# Altium project IPT-LXe.PrjPCB (part 1 of 2)
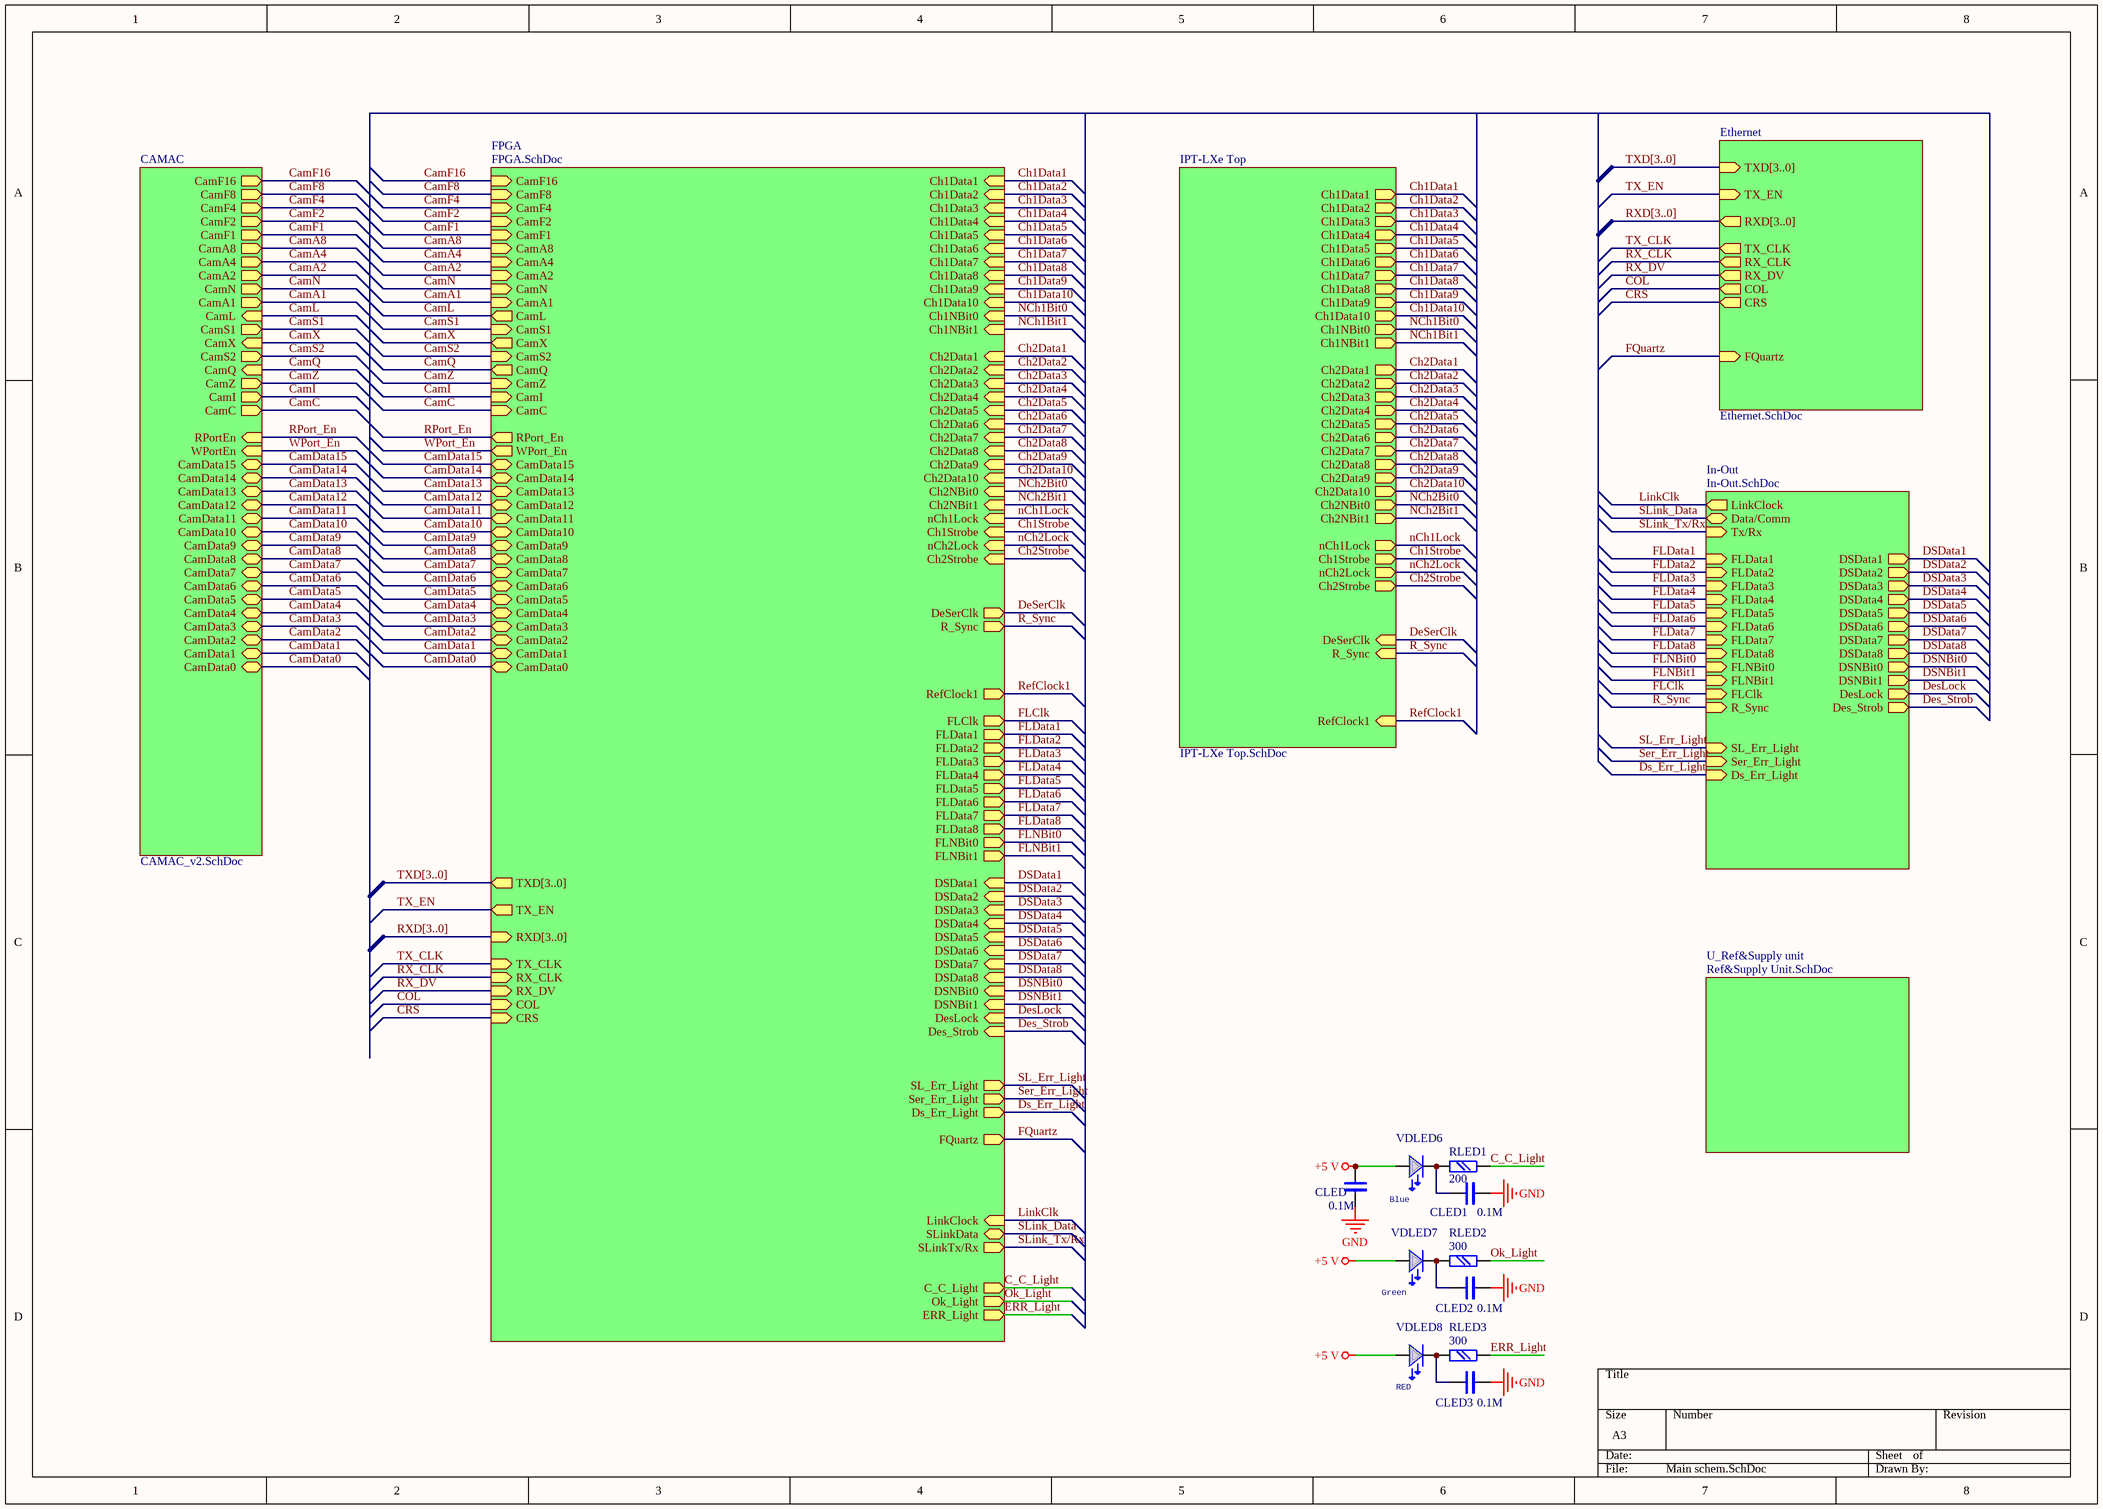
[diagram p0: Main schem.SchDoc]
6 sheets, 225 parts. Net scope: hierarchical (ports join the sheet entries above them; power ports are global).
Board file: IPT-LXe.PcbDoc
Sheets:
  Main schem.SchDoc
    U_Ref&Supply unit = Ref&Supply Unit.SchDoc
    In-Out = In-Out.SchDoc
    CAMAC = CAMAC_v2.SchDoc
    IPT-LXe Top = IPT-LXe Top.SchDoc
    FPGA = FPGA.SchDoc

## Sheet Main schem.SchDoc
size A3

### Parts
CLED  0.1M  [chip0805]
CLED1  0.1M  [chip0805]
CLED2  0.1M  [chip0805]
CLED3  0.1M  [chip0805]
RLED1  200  [chip0805]
RLED2  300  [chip0805]
RLED3  300  [chip0805]
VDLED6  LED  [LED2P5_H]  (value not drawn)
VDLED7  LED  [LED2P5_H]  (value not drawn)
VDLED8  LED  [LED2P5_H]  (value not drawn)

### Sub-sheets
CAMAC = CAMAC_v2.SchDoc: CamF1 (out), CamF2 (out), CamF4 (out), CamF8 (out), CamF16 (out), CamA8 (out), CamA4 (out), CamA2 (out), CamA1 (out), CamN (out), CamS1 (out), CamS2 (out), CamL (in), CamX (in), CamQ (in), CamData1 (bidir), CamData2 (bidir), CamData3 (bidir), CamData4 (bidir), CamData5 (bidir), CamData6 (bidir), CamData7 (bidir), CamData8 (bidir), CamData9 (bidir), CamData10 (bidir), CamData11 (bidir), CamData12 (bidir), CamData13 (bidir), CamData14 (bidir), CamData15 (bidir), CamData0 (bidir), CamI (out), CamZ (out), CamC (out), WPortEn (in), RPortEn (in)
Ethernet = Ethernet.SchDoc (file not in this document): COL (out), TX_EN (in), TX_CLK (out), RX_CLK (out), RX_DV (out), TXD[3..0] (in), RXD[3..0] (out), CRS (out), FQuartz (in)
FPGA = FPGA.SchDoc: ERR_Light (out), Ok_Light (out), C_C_Light (out), SLinkData (bidir), SLinkTx/Rx (out), Ch1Data1 (in), Ch1Data2 (in), Ch1Data3 (in), Ch1Data4 (in), Ch1Data5 (in), Ch1Data6 (in), Ch1Data7 (in), Ch1Data8 (in), Ch1NBit0 (in), Ch1NBit1 (in), Ch1Data9 (in), Ch1Data10 (in), LinkClock (in), CamF1 (in), CamF2 (in), CamF4 (in), CamF8 (in), CamF16 (in), CamA8 (in), CamA4 (in), CamA2 (in), CamA1 (in), CamN (in), CamS1 (in), CamS2 (in), CamL (out), CamX (out), CamQ (out), Ch2Data1 (in), Ch2Data2 (in), Ch2Data3 (in), Ch2Data4 (in), Ch2Data5 (in), Ch2Data6 (in), Ch2Data7 (in), Ch2Data8 (in), Ch2NBit0 (in), Ch2NBit1 (in), DeSerClk (out), R_Sync (out), Ch2Data9 (in), Ch2Data10 (in), nCh2Lock (in), Ch2Strobe (in), nCh1Lock (in), Ch1Strobe (in), RefClock1 (out), CamData1 (bidir), CamData2 (bidir), CamData3 (bidir), CamData4 (bidir), CamData5 (bidir), CamData6 (bidir), CamData7 (bidir), CamData8 (bidir), CamData9 (bidir), CamData10 (bidir), CamData11 (bidir), CamData12 (bidir), CamData13 (bidir), CamData14 (bidir), CamData15 (bidir), CamData0 (bidir), FLData1 (out), FLData2 (out), FLData3 (out), FLData4 (out), FLData5 (out), FLData6 (out), FLData7 (out), FLData8 (out), FLNBit0 (out), FLNBit1 (out), DSData1 (in), DSData2 (in), DSData3 (in), DSData4 (in), DSData5 (in), DSData6 (in), DSData7 (in), DSData8 (in), DSNBit0 (in), DSNBit1 (in), DesLock (in), Des_Strob (in), CamI (in), CamZ (in), CamC (in), Ser_Err_Light (out), Ds_Err_Light (out), FQuartz (out), SL_Err_Light (out), COL (in), TX_EN (out), TX_CLK (in), RX_CLK (in), RX_DV (in), TXD[3..0] (out), CRS (in), RXD[3..0] (in), WPort_En (out), RPort_En (out), FLClk (out)
In-Out = In-Out.SchDoc: Tx/Rx (in), Data/Comm (bidir), LinkClock (out), FLData1 (in), FLData2 (in), FLData3 (in), FLData4 (in), FLData5 (in), FLData6 (in), FLData7 (in), FLData8 (in), FLNBit0 (in), FLNBit1 (in), FLClk (in), R_Sync (in), DSData1 (out), DSData2 (out), DSData3 (out), DSData4 (out), DSData5 (out), DSData6 (out), DSData7 (out), DSData8 (out), DSNBit0 (out), DSNBit1 (out), DesLock (out), Des_Strob (out), Ser_Err_Light (in), Ds_Err_Light (in), SL_Err_Light (in)
IPT-LXe Top = IPT-LXe Top.SchDoc: RefClock1 (in), Ch1Data1 (out), Ch1Data2 (out), Ch1Data3 (out), Ch1Data4 (out), Ch1Data5 (out), Ch1Data6 (out), Ch1Data7 (out), Ch1Data8 (out), Ch1NBit0 (out), Ch1NBit1 (out), Ch1Data9 (out), Ch1Data10 (out), Ch2Data1 (out), Ch2Data2 (out), Ch2Data3 (out), Ch2Data4 (out), Ch2Data5 (out), Ch2Data6 (out), Ch2Data7 (out), Ch2Data8 (out), Ch2NBit0 (out), Ch2NBit1 (out), Ch2Data9 (out), Ch2Data10 (out), DeSerClk (in), R_Sync (in), nCh2Lock (out), Ch2Strobe (out), nCh1Lock (out), Ch1Strobe (out)
U_Ref&Supply unit = Ref&Supply Unit.SchDoc: no entries

### Nets
+5 V: CLED.1 VDLED6.ANOD VDLED7.ANOD VDLED8.ANOD
gnd: CLED.2 CLED1.2 CLED2.2 CLED3.2
C_C_Light: RLED1.2 ; sheet FPGA/C_C_Light
CamA1: sheet CAMAC/CamA1, sheet FPGA/CamA1  [project net A1]
CamA2: sheet CAMAC/CamA2, sheet FPGA/CamA2  [project net A2]
CamA4: sheet CAMAC/CamA4, sheet FPGA/CamA4  [project net A4]
CamA8: sheet CAMAC/CamA8, sheet FPGA/CamA8  [project net A8]
CamC: sheet CAMAC/CamC, sheet FPGA/CamC  [project net C]
CamData0: sheet CAMAC/CamData0, sheet FPGA/CamData0  [project net Cam_Data0]
CamData1: sheet CAMAC/CamData1, sheet FPGA/CamData1  [project net Cam_Data1]
CamData2: sheet CAMAC/CamData2, sheet FPGA/CamData2  [project net Cam_Data2]
CamData3: sheet CAMAC/CamData3, sheet FPGA/CamData3  [project net Cam_Data3]
CamData4: sheet CAMAC/CamData4, sheet FPGA/CamData4  [project net Cam_Data4]
CamData5: sheet CAMAC/CamData5, sheet FPGA/CamData5  [project net Cam_Data5]
CamData6: sheet CAMAC/CamData6, sheet FPGA/CamData6  [project net Cam_Data6]
CamData7: sheet CAMAC/CamData7, sheet FPGA/CamData7  [project net Cam_Data7]
CamData8: sheet CAMAC/CamData8, sheet FPGA/CamData8  [project net Cam_Data8]
CamData9: sheet CAMAC/CamData9, sheet FPGA/CamData9  [project net Cam_Data9]
CamData10: sheet CAMAC/CamData10, sheet FPGA/CamData10  [project net Cam_Data10]
CamData11: sheet CAMAC/CamData11, sheet FPGA/CamData11  [project net Cam_Data11]
CamData12: sheet CAMAC/CamData12, sheet FPGA/CamData12  [project net Cam_Data12]
CamData13: sheet CAMAC/CamData13, sheet FPGA/CamData13  [project net Cam_Data13]
CamData14: sheet CAMAC/CamData14, sheet FPGA/CamData14  [project net Cam_Data14]
CamData15: sheet CAMAC/CamData15, sheet FPGA/CamData15  [project net Cam_Data15]
CamF1: sheet CAMAC/CamF1, sheet FPGA/CamF1
CamF2: sheet CAMAC/CamF2, sheet FPGA/CamF2
CamF4: sheet CAMAC/CamF4, sheet FPGA/CamF4
CamF8: sheet CAMAC/CamF8, sheet FPGA/CamF8
CamF16: sheet CAMAC/CamF16, sheet FPGA/CamF16
CamI: sheet CAMAC/CamI, sheet FPGA/CamI
CamL: sheet CAMAC/CamL, sheet FPGA/CamL
CamN: sheet CAMAC/CamN, sheet FPGA/CamN
CamQ: sheet CAMAC/CamQ, sheet FPGA/CamQ
CamS1: sheet CAMAC/CamS1, sheet FPGA/CamS1
CamS2: sheet CAMAC/CamS2, sheet FPGA/CamS2
CamX: sheet CAMAC/CamX, sheet FPGA/CamX
CamZ: sheet CAMAC/CamZ, sheet FPGA/CamZ
Ch1Data1: sheet IPT-LXe Top/Ch1Data1, sheet FPGA/Ch1Data1
Ch1Data2: sheet IPT-LXe Top/Ch1Data2, sheet FPGA/Ch1Data2
Ch1Data3: sheet IPT-LXe Top/Ch1Data3, sheet FPGA/Ch1Data3
Ch1Data4: sheet IPT-LXe Top/Ch1Data4, sheet FPGA/Ch1Data4
Ch1Data5: sheet IPT-LXe Top/Ch1Data5, sheet FPGA/Ch1Data5
Ch1Data6: sheet IPT-LXe Top/Ch1Data6, sheet FPGA/Ch1Data6
Ch1Data7: sheet IPT-LXe Top/Ch1Data7, sheet FPGA/Ch1Data7
Ch1Data8: sheet IPT-LXe Top/Ch1Data8, sheet FPGA/Ch1Data8
Ch1Data9: sheet IPT-LXe Top/Ch1Data9, sheet FPGA/Ch1Data9
Ch1Data10: sheet IPT-LXe Top/Ch1Data10, sheet FPGA/Ch1Data10
Ch1Strobe: sheet IPT-LXe Top/Ch1Strobe, sheet FPGA/Ch1Strobe
Ch2Data1: sheet IPT-LXe Top/Ch2Data1, sheet FPGA/Ch2Data1
Ch2Data2: sheet IPT-LXe Top/Ch2Data2, sheet FPGA/Ch2Data2
Ch2Data3: sheet IPT-LXe Top/Ch2Data3, sheet FPGA/Ch2Data3
Ch2Data4: sheet IPT-LXe Top/Ch2Data4, sheet FPGA/Ch2Data4
Ch2Data5: sheet IPT-LXe Top/Ch2Data5, sheet FPGA/Ch2Data5
Ch2Data6: sheet IPT-LXe Top/Ch2Data6, sheet FPGA/Ch2Data6
Ch2Data7: sheet IPT-LXe Top/Ch2Data7, sheet FPGA/Ch2Data7
Ch2Data8: sheet IPT-LXe Top/Ch2Data8, sheet FPGA/Ch2Data8
Ch2Data9: sheet IPT-LXe Top/Ch2Data9, sheet FPGA/Ch2Data9
Ch2Data10: sheet IPT-LXe Top/Ch2Data10, sheet FPGA/Ch2Data10
Ch2Strobe: sheet IPT-LXe Top/Ch2Strobe, sheet FPGA/Ch2Strobe
COL: sheet Ethernet/COL, sheet FPGA/COL
CRS: sheet Ethernet/CRS, sheet FPGA/CRS
Des_Strob: sheet In-Out/Des_Strob, sheet FPGA/Des_Strob
DeSerClk: sheet IPT-LXe Top/DeSerClk, sheet FPGA/DeSerClk
DesLock: sheet In-Out/DesLock, sheet FPGA/DesLock
Ds_Err_Light: sheet In-Out/Ds_Err_Light, sheet FPGA/Ds_Err_Light
DSData1: sheet In-Out/DSData1, sheet FPGA/DSData1  [project net Des_Out0]
DSData2: sheet In-Out/DSData2, sheet FPGA/DSData2  [project net Des_Out1]
DSData3: sheet In-Out/DSData3, sheet FPGA/DSData3  [project net Des_Out2]
DSData4: sheet In-Out/DSData4, sheet FPGA/DSData4  [project net Des_Out3]
DSData5: sheet In-Out/DSData5, sheet FPGA/DSData5  [project net Des_Out4]
DSData6: sheet In-Out/DSData6, sheet FPGA/DSData6  [project net Des_Out5]
DSData7: sheet In-Out/DSData7, sheet FPGA/DSData7  [project net Des_Out6]
DSData8: sheet In-Out/DSData8, sheet FPGA/DSData8  [project net Des_Out7]
DSNBit0: sheet In-Out/DSNBit0, sheet FPGA/DSNBit0  [project net Des_Out8]
DSNBit1: sheet In-Out/DSNBit1, sheet FPGA/DSNBit1  [project net Des_Out9]
ERR_Light: RLED3.2 ; sheet FPGA/ERR_Light
FLClk: sheet In-Out/FLClk, sheet FPGA/FLClk
FLData1: sheet In-Out/FLData1, sheet FPGA/FLData1
FLData2: sheet In-Out/FLData2, sheet FPGA/FLData2
FLData3: sheet In-Out/FLData3, sheet FPGA/FLData3
FLData4: sheet In-Out/FLData4, sheet FPGA/FLData4
FLData5: sheet In-Out/FLData5, sheet FPGA/FLData5
FLData6: sheet In-Out/FLData6, sheet FPGA/FLData6
FLData7: sheet In-Out/FLData7, sheet FPGA/FLData7
FLData8: sheet In-Out/FLData8, sheet FPGA/FLData8
FLNBit0: sheet In-Out/FLNBit0, sheet FPGA/FLNBit0
FLNBit1: sheet In-Out/FLNBit1, sheet FPGA/FLNBit1
FQuartz: sheet Ethernet/FQuartz, sheet FPGA/FQuartz
LinkClk: sheet In-Out/LinkClock, sheet FPGA/LinkClock
NCh1Bit0: sheet IPT-LXe Top/Ch1NBit0, sheet FPGA/Ch1NBit0  [project net Ch1Data11]
NCh1Bit1: sheet IPT-LXe Top/Ch1NBit1, sheet FPGA/Ch1NBit1  [project net Ch1Data12]
nCh1Lock: sheet IPT-LXe Top/nCh1Lock, sheet FPGA/nCh1Lock
NCh2Bit0: sheet IPT-LXe Top/Ch2NBit0, sheet FPGA/Ch2NBit0  [project net Ch2Data11]
NCh2Bit1: sheet IPT-LXe Top/Ch2NBit1, sheet FPGA/Ch2NBit1  [project net Ch2Data12]
nCh2Lock: sheet IPT-LXe Top/nCh2Lock, sheet FPGA/nCh2Lock
Ok_Light: RLED2.2 ; sheet FPGA/Ok_Light
R_Sync: sheet In-Out/R_Sync, sheet IPT-LXe Top/R_Sync, sheet FPGA/R_Sync
RefClock1: sheet IPT-LXe Top/RefClock1, sheet FPGA/RefClock1
RPort_En: sheet CAMAC/RPortEn, sheet FPGA/RPort_En
RX_CLK: sheet Ethernet/RX_CLK, sheet FPGA/RX_CLK  [project net EthRX_CLK]
RX_DV: sheet Ethernet/RX_DV, sheet FPGA/RX_DV  [project net EthRX_D V]
Ser_Err_Light: sheet In-Out/Ser_Err_Light, sheet FPGA/Ser_Err_Light
SL_Err_Light: sheet In-Out/SL_Err_Light, sheet FPGA/SL_Err_Light
SLink_Data: sheet In-Out/Data/Comm, sheet FPGA/SLinkData
SLink_Tx/Rx: sheet In-Out/Tx/Rx, sheet FPGA/SLinkTx/Rx
TX_CLK: sheet Ethernet/TX_CLK, sheet FPGA/TX_CLK  [project net EthTX_CLK]
TX_EN: sheet Ethernet/TX_EN, sheet FPGA/TX_EN  [project net EthTX_EN]
WPort_En: sheet CAMAC/WPortEn, sheet FPGA/WPort_En
NetCLED1_1: CLED1.1 RLED1.1 VDLED6.CATH
NetCLED2_1: CLED2.1 RLED2.1 VDLED7.CATH
NetCLED3_1: CLED3.1 RLED3.1 VDLED8.CATH

### Buses and harness runs
bus RXD[3..0] = sheet Ethernet/RXD[3..0]
bus RXD[3..0] = sheet FPGA/RXD[3..0]
bus TXD[3..0] = sheet Ethernet/TXD[3..0]
bus TXD[3..0] = sheet FPGA/TXD[3..0]

### Notes on the sheet
- Blue
- (near VDLED7) Green
- (near VDLED8) RED

### Library data of the parts
CLED CLED1-CLED3 = C: Text Field1: 20; Text Field2: 10
RLED1-RLED3 = R: Text Field1: 20; Text Field2: 20
VDLED6-VDLED8 = AL307: Text Field1: 10; Text Field2: 30

## Sheet Ref&Supply Unit.SchDoc
size A4
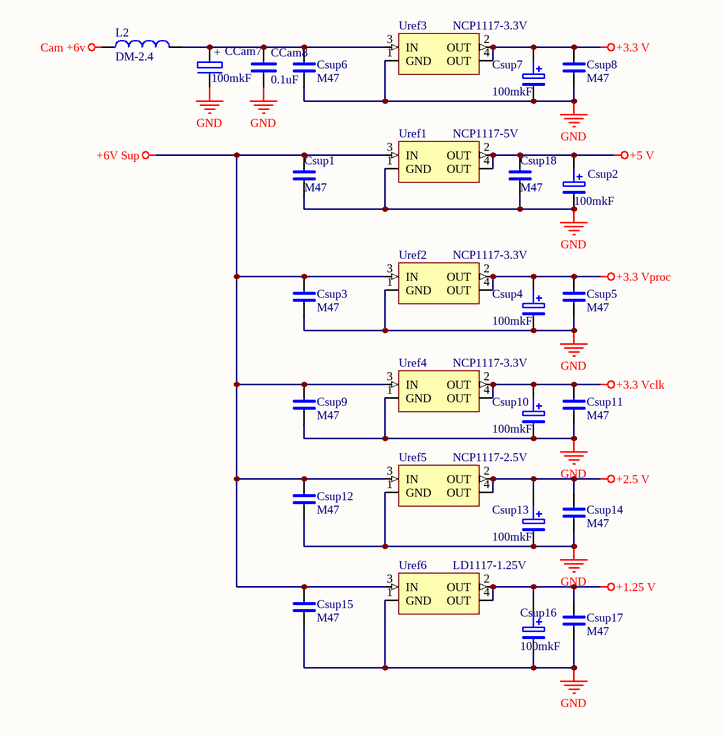
[diagram p1: Ref&Supply Unit.SchDoc]

### Parts
CCam7  100mkF  [CEL-SMD300]
CCam8  0.1uF  [chip0805]
Csup1  M47  [chip0805]
Csup2  100mkF  [CEL-SMD300]
Csup3  M47  [chip0805]
Csup4  100mkF  [CEL-SMD300]
Csup5  M47  [chip0805]
Csup6  M47  [chip0805]
Csup7  100mkF  [CEL-SMD300]
Csup8  M47  [chip0805]
Csup9  M47  [chip0805]
Csup10  100mkF  [CEL-SMD300]
Csup11  M47  [chip0805]
Csup12  M47  [chip0805]
Csup13  100mkF  [CEL-SMD300]
Csup14  M47  [chip0805]
Csup15  M47  [chip0805]
Csup16  100mkF  [CEL-SMD300]
Csup17  M47  [chip0805]
Csup18  M47  [chip0805]
L2  DM-2.4  [DM-2.4]
Uref1  NCP1117-5V  [SOT-223]
Uref2  NCP1117-3.3V  [TO-252]
Uref3  NCP1117-3.3V  [TO-252]
Uref4  NCP1117-3.3V  [TO-252]
Uref5  NCP1117-2.5V  [TO-252]
Uref6  LD1117-1.25V  [TO-252]

### Nets
+1.25 V: Csup16.+ Csup17.1 Uref6.2(OUT) Uref6.4(OUT)
+2.5 V: Csup13.+ Csup14.1 Uref5.2(OUT) Uref5.4(OUT)
+3.3 V: Csup7.+ Csup8.1 Uref3.2(OUT) Uref3.4(OUT)
+3.3 Vclk: Csup10.+ Csup11.1 Uref4.2(OUT) Uref4.4(OUT)
+3.3 Vproc: Csup4.+ Csup5.1 Uref2.2(OUT) Uref2.4(OUT)
+5 V: Csup2.+ Csup18.1 Uref1.2(OUT) Uref1.4(OUT)
+6V Sup: Csup1.1 Csup3.1 Csup9.1 Csup12.1 Csup15.1 Uref1.3(IN) Uref2.3(IN) Uref4.3(IN) Uref5.3(IN) Uref6.3(IN)
Cam +6v: L2.1
gnd: CCam7.- CCam8.2 Csup1.2 Csup2.- Csup3.2 Csup4.- Csup5.2 Csup6.2 Csup7.- Csup8.2 Csup9.2 Csup10.- Csup11.2 Csup12.2 Csup13.- Csup14.2 Csup15.2 Csup16.- Csup17.2 Csup18.2 Uref1.1(GND) Uref2.1(GND) Uref3.1(GND) Uref4.1(GND) Uref5.1(GND) Uref6.1(GND)
NetCCam7_+: CCam7.+ CCam8.1 Csup6.1 L2.2 Uref3.3(IN)

### Library data of the parts
CCam7 = C POL
CCam8 = C
Csup1 Csup3 Csup5 Csup6 Csup8 Csup9 Csup11 Csup12 Csup14 Csup15 Csup17 Csup18 = C: Text Field1: 20; Text Field2: 10
Csup2 Csup4 Csup7 Csup10 Csup13 Csup16 = C POL: Text Field1: 20; Text Field2: 20
L2 = INDUCTOR
Uref1 Uref5 Uref6 = NCP1117-3.3V

## Sheet In-Out.SchDoc
size A3
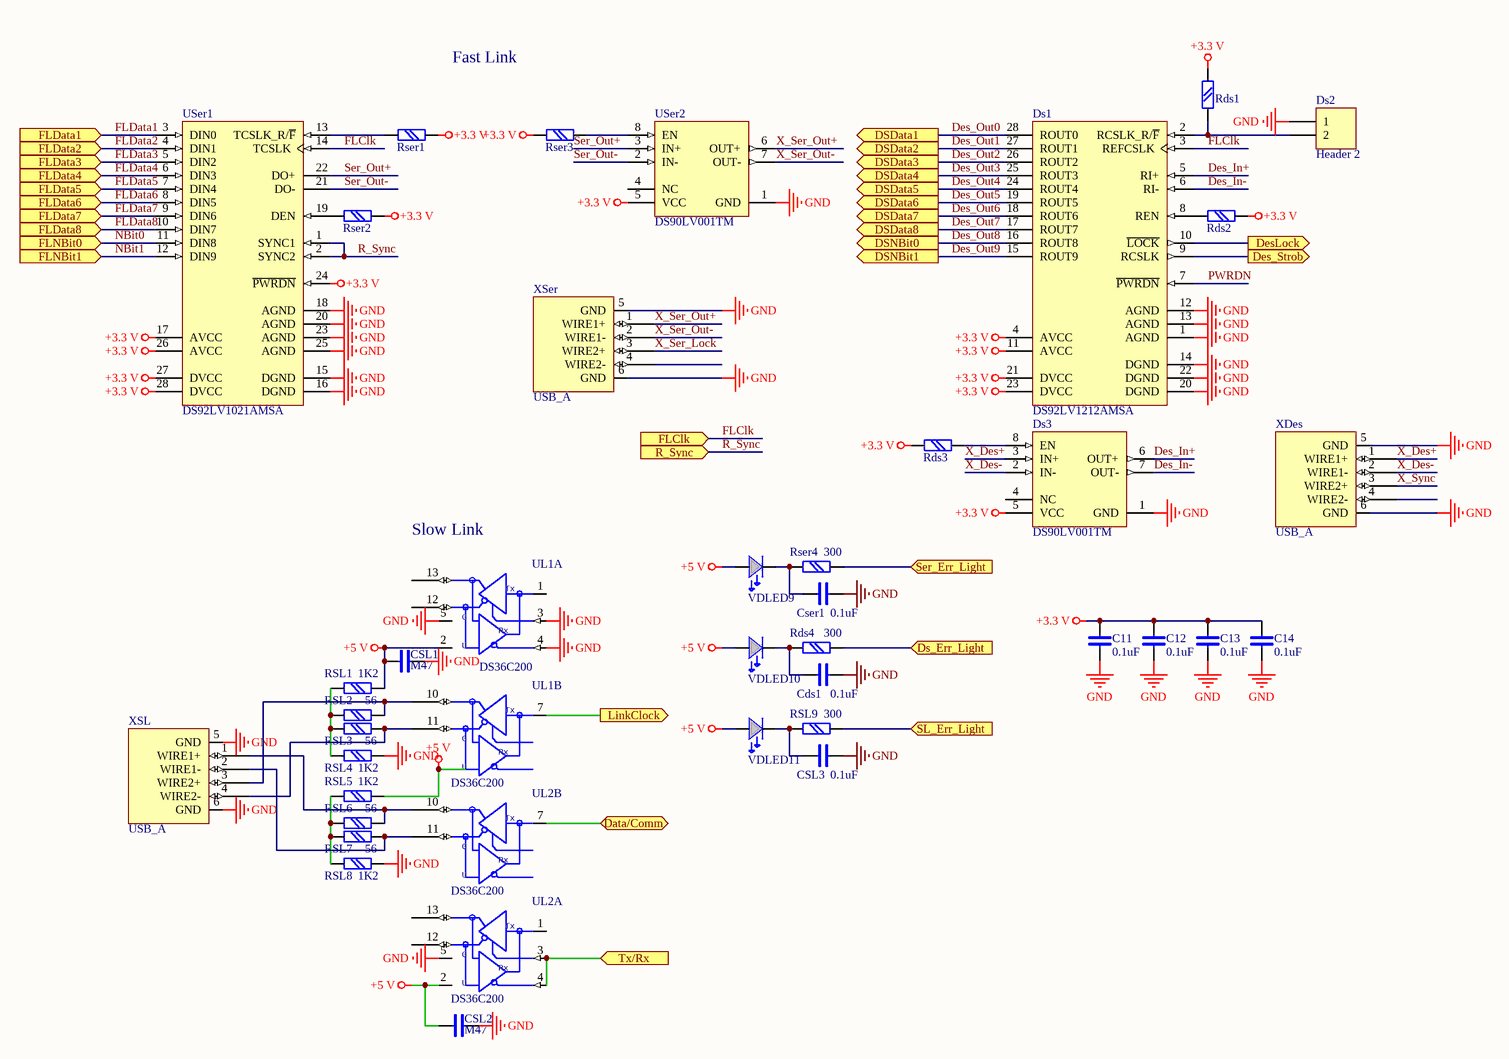
[diagram p2: In-Out.SchDoc]

### Parts
C11  0.1uF  [chip0805]
C12  0.1uF  [chip0805]
C13  0.1uF  [chip0805]
C14  0.1uF  [chip0805]
Cds1  0.1uF  [chip0805]
Cser1  0.1uF  [chip0805]
CSL1  M47  [chip0805]
CSL2  M47  [chip0805]
CSL3  0.1uF  [chip0805]
Ds1  DS92LV1212AMSA  [MSA28_N]
Ds2  Header 2  [HDR1X2]
Ds3  DS90LV001TM  [M08A_N]
Rds1  R  [chip0805]  (value not drawn)
Rds2  R  [chip0805]  (value not drawn)
Rds3  R  [chip0805]  (value not drawn)
Rds4  300  [chip0805]
Rser1  R  [chip0805]  (value not drawn)
Rser2  R  [chip0805]  (value not drawn)
Rser3  R  [chip0805]  (value not drawn)
Rser4  300  [chip0805]
RSL1  1K2  [chip0805]
RSL2  56  [chip0805]
RSL3  56  [chip0805]
RSL4  1K2  [chip0805]
RSL5  1K2  [chip0805]
RSL6  56  [chip0805]
RSL7  56  [chip0805]
RSL8  1K2  [chip0805]
RSL9  300  [chip0805]
UL1  DS36C200  [M14A_N]  (parts A,B of 2)
UL2  DS36C200  [M14A_N]  (parts A,B of 2)
USer1  DS92LV1021AMSA  [MSA28_N]
USer2  DS90LV001TM  [M08A_N]
VDLED9  LED  [LED2P5_H]  (value not drawn)
VDLED10  LED  [LED2P5_H]  (value not drawn)
VDLED11  LED  [LED2P5_H]  (value not drawn)
XDes  USB_A  [USB2.5-2H4B]
XSer  USB_A  [USB2.5-2H4B]
XSL  USB_A  [USB2.5-2H4B]

### Ports
Data/Comm (bidir), Des_Strob (out), DesLock (out), Ds_Err_Light (in), DSData1 (out), DSData2 (out), DSData3 (out), DSData4 (out), DSData5 (out), DSData6 (out), DSData7 (out), DSData8 (out), DSNBit0 (out), DSNBit1 (out), FLClk (in), FLData1 (in), FLData2 (in), FLData3 (in), FLData4 (in), FLData5 (in), FLData6 (in), FLData7 (in), FLData8 (in), FLNBit0 (in), FLNBit1 (in), LinkClock (out), R_Sync (in), Ser_Err_Light (in), SL_Err_Light (in), Tx/Rx (in)

### Nets
+3.3 V: C11.2 C12.2 C13.2 C14.2 Ds1.4(AVCC) Ds1.11(AVCC) Ds1.21(DVCC) Ds1.23(DVCC) Ds3.5(VCC) Rds1.1 Rds2.2 Rds3.2 Rser1.1 Rser2.2 Rser3.2 USer1.17(AVCC) USer1.24(~{PWRDN}) USer1.26(AVCC) USer1.27(DVCC) USer1.28(DVCC) USer2.5(VCC)
+5 V: CSL1.1 CSL2.1 RSL1.2 RSL5.2 UL1.2(VCC) UL2.2(VCC) VDLED9.ANOD VDLED10.ANOD VDLED11.ANOD
gnd: C11.1 C12.1 C13.1 C14.1 Cds1.2 Cser1.2 CSL1.2 CSL2.2 CSL3.2 Ds1.1(AGND) Ds1.12(AGND) Ds1.13(AGND) Ds1.14(DGND) Ds1.20(DGND) Ds1.22(DGND) Ds2.1 Ds3.1(GND) RSL4.2 RSL8.2 UL1.3(TE) UL1.4(RE) UL1.5(GND) UL2.5(GND) USer1.15(DGND) USer1.16(DGND) USer1.18(AGND) USer1.20(AGND) USer1.23(AGND) USer1.25(AGND) USer2.1(GND) XDes.5(GND) XDes.6(GND) XSer.5(GND) XSer.6(GND) XSL.5(GND) XSL.6(GND)
Des_In+: Ds1.5(RI+) Ds3.6(OUT+)
Des_In-: Ds1.6(RI-) Ds3.7(OUT-)
Des_Out0: Ds1.28(ROUT0) ; port DSData1
Des_Out1: Ds1.27(ROUT1) ; port DSData2
Des_Out2: Ds1.26(ROUT2) ; port DSData3
Des_Out3: Ds1.25(ROUT3) ; port DSData4
Des_Out4: Ds1.24(ROUT4) ; port DSData5
Des_Out5: Ds1.19(ROUT5) ; port DSData6
Des_Out6: Ds1.18(ROUT6) ; port DSData7
Des_Out7: Ds1.17(ROUT7) ; port DSData8
Des_Out8: Ds1.16(ROUT8) ; port DSNBit0
Des_Out9: Ds1.15(ROUT9) ; port DSNBit1
Des_Strob: Ds1.9(RCSLK) ; port Des_Strob
DesLock: Ds1.10(~{LOCK}) ; port DesLock
Ds_Err_Light: Rds4.1 ; port Ds_Err_Light
FLClk: Ds1.3(REFCSLK) USer1.14(TCSLK) ; port FLClk
FLData1: USer1.3(DIN0) ; port FLData1
FLData2: USer1.4(DIN1) ; port FLData2
FLData3: USer1.5(DIN2) ; port FLData3
FLData4: USer1.6(DIN3) ; port FLData4
FLData5: USer1.7(DIN4) ; port FLData5
FLData6: USer1.8(DIN5) ; port FLData6
FLData7: USer1.9(DIN6) ; port FLData7
FLData8: USer1.10(DIN7) ; port FLData8
LinkClk: UL1.7(DATA) ; port LinkClock
NBit0: USer1.11(DIN8) ; port FLNBit0  [project net FLNBit0]
NBit1: USer1.12(DIN9) ; port FLNBit1  [project net FLNBit1]
PWRDN: Ds1.7(~{PWRDN})
R_Sync: USer1.1(SYNC1) USer1.2(SYNC2) ; port R_Sync
Ser_Err_Light: Rser4.1 ; port Ser_Err_Light
Ser_Out+: USer1.22(DO+) USer2.3(IN+)
Ser_Out-: USer1.21(DO-) USer2.2(IN-)
SL_Err_Light: RSL9.1 ; port SL_Err_Light
SLink_Data: UL2.7(DATA) ; port Data/Comm
SLink_Tx/Rx: UL2.3(TE) UL2.4(RE) ; port Tx/Rx
X_Des+: Ds3.3(IN+) XDes.1(WIRE1+)
X_Des-: Ds3.2(IN-) XDes.2(WIRE1-)
X_Ser_Lock: XSer.3(WIRE2+)
X_Ser_Out+: USer2.6(OUT+) XSer.1(WIRE1+)
X_Ser_Out-: USer2.7(OUT-) XSer.2(WIRE1-)
X_Sync: XDes.3(WIRE2+)
NetCds1_1: Cds1.1 Rds4.2 VDLED10.CATH
NetCser1_1: Cser1.1 Rser4.2 VDLED9.CATH
NetCSL3_1: CSL3.1 RSL9.2 VDLED11.CATH
NetDs1_2: Ds1.2(RCSLK_R/~{F}) Ds2.2 Rds1.2
NetDs1_8: Ds1.8(REN) Rds2.1
NetDs3_8: Ds3.8(EN) Rds3.1
NetRser1_2: Rser1.2 USer1.13(TCSLK_R/~{F})
NetRser2_1: Rser2.1 USer1.19(DEN)
NetRser3_1: Rser3.1 USer2.8(EN)
NetRSL1_1: RSL1.1 RSL2.1 RSL3.1 RSL4.1
NetRSL2_2: RSL2.2 UL1.10(WIRE+) XSL.3(WIRE2+)
NetRSL3_2: RSL3.2 UL1.11(WIRE-) XSL.4(WIRE2-)
NetRSL5_1: RSL5.1 RSL6.1 RSL7.1 RSL8.1
NetRSL6_2: RSL6.2 UL2.10(WIRE+) XSL.1(WIRE1+)
NetRSL7_2: RSL7.2 UL2.11(WIRE-) XSL.2(WIRE1-)

Not connected (* = marked no-connect by the designer): Ds3 4(NC); UL1 1(DATA) 12(WIRE-) 13(WIRE+); UL2 1(DATA) 12(WIRE-) 13(WIRE+); USer2 4(NC); XDes 4(WIRE2-); XSer 4(WIRE2-)

### Notes on the sheet
- Fast Link
- (near UL1) Slow Link
- (in symbol DS36C200, part A) Tx; G; Rx; U
- (in symbol DS36C200, part B) Tx; G; Rx; U

### Library data of the parts
C11-C14 Cds1 Cser1 CSL1-CSL3 = C: Text Field1: 20; Text Field2: 10
Ds1 = DS92LV1212AMSA: 16 MHz - 40 MHz 10-Bit Bus LVDS Random Lock Deserializer with Embedded Clock Recovery, 28-pin SSOP-EIAJ; Manufacturer: National Semiconductor; PackageTopMarking: NSUZXYTTE#*DS92LV1212A*MSA; PowerWise: N; CompType: Interface IC; Published: 4-Dec-2008; DatasheetVersion: Nov-2000; PackageVersion: revC, Oct-2009; PackageReference: MSA28; Publisher: Altium Limited; PackageDescription: Molded SSOP, 5.3mm Body Width, 0.65mm Pitch, EIAJ, Type II, 28 Lead; Supplier 1: Farnell; Supplier Part Number 1: 7610683; PartNumber: DS92LV1212AMSA; RoHS: N; PinCount: 28; Code_IPC: SOP65P780-28; ComponentLink1Description: DS92LV1212A Datasheet; ComponentLink1URL: http://www.national.com/ds/DS/DS92LV1212A.pdf; ComponentLink2Description: DS92LV1212A Web Page; ComponentLink2URL: http://www.national.com/pf/DS/DS92LV1212A.html; ComponentLink3Description: MSA28 Package Page; ComponentLink3URL: http://www.national.com/packaging/folders/msa28.html
Ds2 = Header 2: Header, 2-Pin; LatestRevisionDate: 17-Jul-2002; LatestRevisionNote: Re-released for DXP Platform.; Publisher: Altium Limited
Ds3 USer2 = DS90LV001TM: 800 Mbps LVDS Buffer, 8-pin Narrow SOIC; Manufacturer: National Semiconductor; PackageTopMarking: NSZXTT*LV001*TM; PowerWise: N; CompType: Interface IC; Published: 4-Dec-2008; DatasheetVersion: Feb-2008; PackageVersion: revM, May-2009; PackageReference: M08A; Publisher: Altium Limited; PackageDescription: SOIC Narrow, 4.9 x 3.9 x 1.45mm, 8 Lead, 1.27mm Pitch; PartNumber: DS90LV001TM; RoHS: N; PinCount: 8; Code_JEDEC: MS-012-AA; Code_IPC: SOIC127P600-8; ComponentLink1Description: DS90LV001 Datasheet; ComponentLink1URL: http://www.national.com/ds/DS/DS90LV001.pdf; ComponentLink2Description: DS90LV001 Web Page; ComponentLink2URL: http://www.national.com/pf/DS/DS90LV001.html; ComponentLink3Description: M08A Package Page; ComponentLink3URL: http://www.national.com/packaging/folders/m08a.html
Rds1-Rds4 Rser1-Rser4 RSL1-RSL9 = R: Text Field1: 20; Text Field2: 20
UL1 UL2 = DS36C200: Text Field1: 60; Text Field2: 70
USer1 = DS92LV1021AMSA: 16 MHz - 40 MHz 10-Bit Serializer, 28-pin SSOP-EIAJ; Manufacturer: National Semiconductor; PackageTopMarking: NSUZXYTTE#*DS92LV1021A*MSA BBBBB; PowerWise: N; CompType: Interface IC; Published: 4-Dec-2008; DatasheetVersion: Jan-2003; PackageVersion: revC, Oct-2009; PackageReference: MSA28; Publisher: Altium Limited; PackageDescription: Molded SSOP, 5.3mm Body Width, 0.65mm Pitch, EIAJ, Type II, 28 Lead; Supplier 1: Farnell; Supplier Part Number 1: 8206830; PartNumber: DS92LV1021AMSA; RoHS: N; PinCount: 28; Code_IPC: SOP65P780-28; ComponentLink1Description: DS92LV1021A Datasheet; ComponentLink1URL: http://www.national.com/ds/DS/DS92LV1021A.pdf; ComponentLink2Description: DS92LV1021A Web Page; ComponentLink2URL: http://www.national.com/pf/DS/DS92LV1021A.html; ComponentLink3Description: MSA28 Package Page; ComponentLink3URL: http://www.national.com/packaging/folders/msa28.html
VDLED9-VDLED11 = AL307: Text Field1: 10; Text Field2: 30
XDes XSer XSL = USB_A: Text Field1: 60; Text Field2: 70

## Sheet CAMAC_v2.SchDoc
size A3
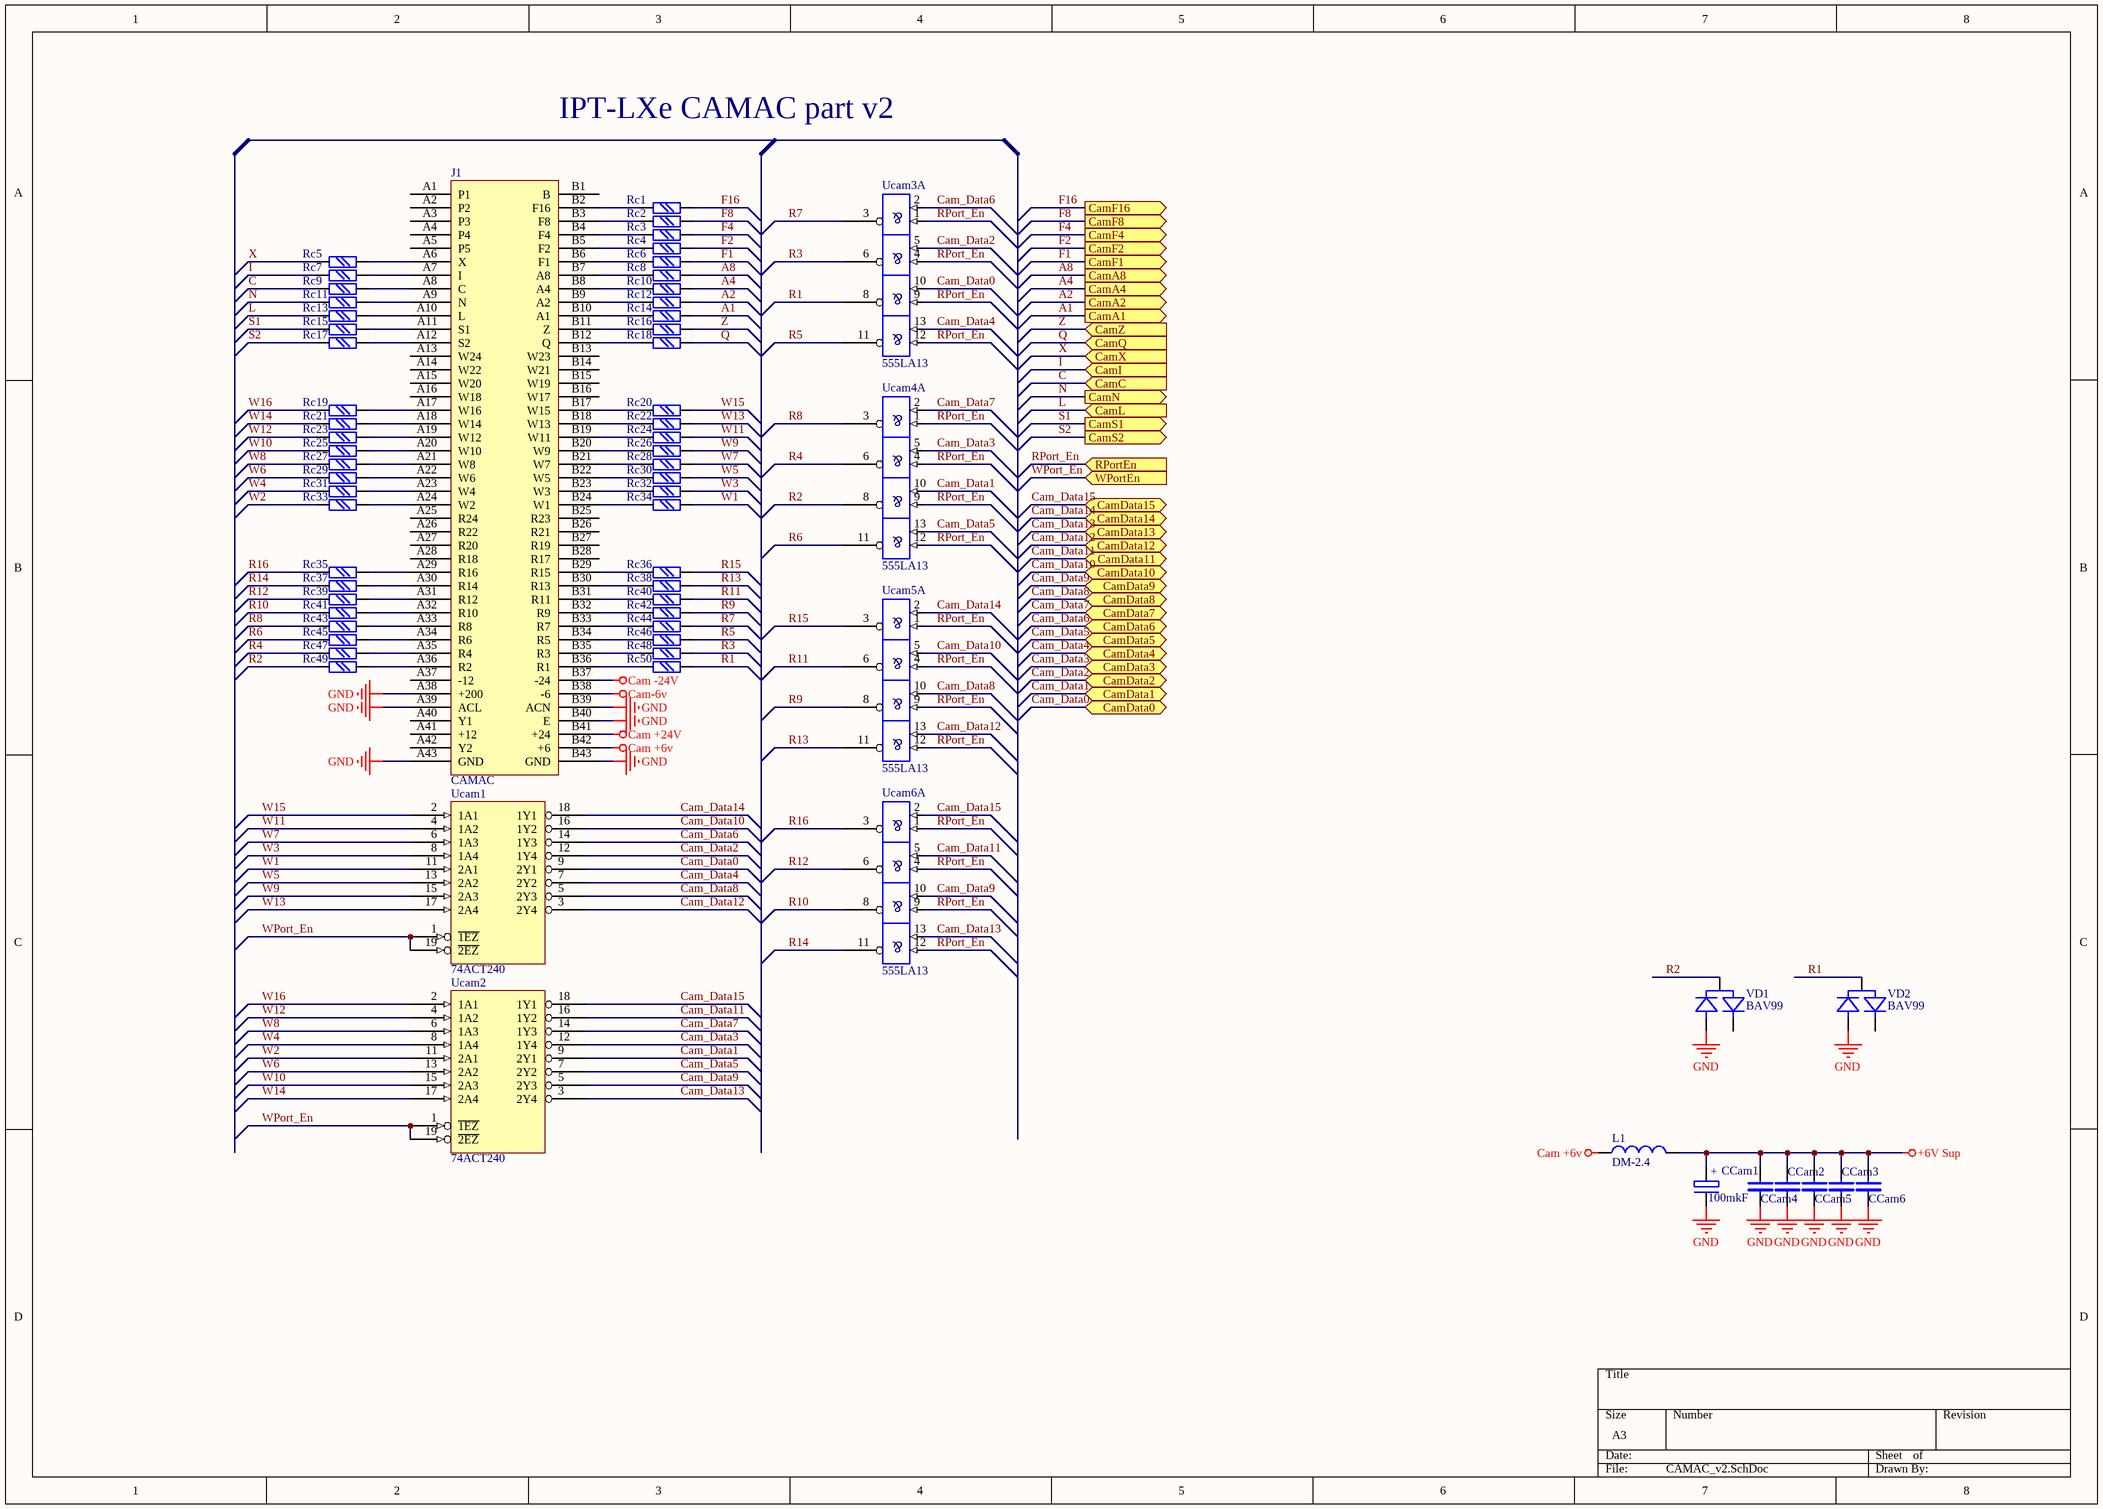
[diagram p3: CAMAC_v2.SchDoc]

### Parts
CCam1  100mkF  [CEL-SMD300]
CCam2  0.1uF  [chip0805]  (value not drawn)
CCam3  0.1uF  [chip0805]  (value not drawn)
CCam4  0.1uF  [chip0805]  (value not drawn)
CCam5  0.1uF  [chip0805]  (value not drawn)
CCam6  0.1uF  [chip0805]  (value not drawn)
J1  CAMAC  [CAMAC - duplicate]
L1  DM-2.4  [DM-2.4]
Rc1  R  [chip0805]  (value not drawn)
Rc2  R  [chip0805]  (value not drawn)
Rc3  R  [chip0805]  (value not drawn)
Rc4  R  [chip0805]  (value not drawn)
Rc5  R  [chip0805]  (value not drawn)
Rc6  R  [chip0805]  (value not drawn)
Rc7  R  [chip0805]  (value not drawn)
Rc8  R  [chip0805]  (value not drawn)
Rc9  R  [chip0805]  (value not drawn)
Rc10  R  [chip0805]  (value not drawn)
Rc11  R  [chip0805]  (value not drawn)
Rc12  R  [chip0805]  (value not drawn)
Rc13  R  [chip0805]  (value not drawn)
Rc14  R  [chip0805]  (value not drawn)
Rc15  R  [chip0805]  (value not drawn)
Rc16  R  [chip0805]  (value not drawn)
Rc17  R  [chip0805]  (value not drawn)
Rc18  R  [chip0805]  (value not drawn)
Rc19  R  [chip0805]  (value not drawn)
Rc20  R  [chip0805]  (value not drawn)
Rc21  R  [chip0805]  (value not drawn)
Rc22  R  [chip0805]  (value not drawn)
Rc23  R  [chip0805]  (value not drawn)
Rc24  R  [chip0805]  (value not drawn)
Rc25  R  [chip0805]  (value not drawn)
Rc26  R  [chip0805]  (value not drawn)
Rc27  R  [chip0805]  (value not drawn)
Rc28  R  [chip0805]  (value not drawn)
Rc29  R  [chip0805]  (value not drawn)
Rc30  R  [chip0805]  (value not drawn)
Rc31  R  [chip0805]  (value not drawn)
Rc32  R  [chip0805]  (value not drawn)
Rc33  R  [chip0805]  (value not drawn)
Rc34  R  [chip0805]  (value not drawn)
Rc35  R  [chip0805]  (value not drawn)
Rc36  R  [chip0805]  (value not drawn)
Rc37  R  [chip0805]  (value not drawn)
Rc38  R  [chip0805]  (value not drawn)
Rc39  R  [chip0805]  (value not drawn)
Rc40  R  [chip0805]  (value not drawn)
Rc41  R  [chip0805]  (value not drawn)
Rc42  R  [chip0805]  (value not drawn)
Rc43  R  [chip0805]  (value not drawn)
Rc44  R  [chip0805]  (value not drawn)
Rc45  R  [chip0805]  (value not drawn)
Rc46  R  [chip0805]  (value not drawn)
Rc47  R  [chip0805]  (value not drawn)
Rc48  R  [chip0805]  (value not drawn)
Rc49  R  [chip0805]  (value not drawn)
Rc50  R  [chip0805]  (value not drawn)
Ucam1  74ACT240  [20SOIC300]
Ucam2  74ACT240  [20SOIC300]
Ucam3  (no value)  [14DIP300]  (parts A,B,C,D of 4)
Ucam4  (no value)  [14DIP300]  (parts A,B,C,D of 4)
Ucam5  (no value)  [14DIP300]  (parts A,B,C,D of 4)
Ucam6  (no value)  [14DIP300]  (parts A,B,C,D of 4)
VD1  BAV99  [SOT23]
VD2  BAV99  [SOT23]

### Ports
CamA1 (out), CamA2 (out), CamA4 (out), CamA8 (out), CamC (in), CamData0 (bidir), CamData1 (bidir), CamData2 (bidir), CamData3 (bidir), CamData4 (bidir), CamData5 (bidir), CamData6 (bidir), CamData7 (bidir), CamData8 (bidir), CamData9 (bidir), CamData10 (bidir), CamData11 (bidir), CamData12 (bidir), CamData13 (bidir), CamData14 (bidir), CamData15 (bidir), CamF1 (out), CamF2 (out), CamF4 (out), CamF8 (out), CamF16 (out), CamI (in), CamL (in), CamN (out), CamQ (in), CamS1 (out), CamS2 (out), CamX (in), CamZ (in), RPortEn (in), WPortEn (in)

### Nets
+6V Sup: CCam1.+ CCam2.1 CCam3.1 CCam4.1 CCam5.1 CCam6.1 L1.2
Cam +6v: J1.B42(+6) L1.1
Cam +24V: J1.B41(+24)
Cam -24V: J1.B37(-24)
Cam-6v: J1.B38(-6)
gnd: CCam1.- CCam2.2 CCam3.2 CCam4.2 CCam5.2 CCam6.2 J1.A38(+200) J1.A39(ACL) J1.A43(GND) J1.B39(ACN) J1.B40(E) J1.B43(GND) Ucam1.10(GND) Ucam2.10(GND) VD1.1 VD2.1
VCC: Ucam1.20(VCC) Ucam2.20(VCC)
A1: Rc14.2 ; port CamA1
A2: Rc12.2 ; port CamA2
A4: Rc10.2 ; port CamA4
A8: Rc8.2 ; port CamA8
C: Rc9.1 ; port CamC
Cam_Data0: Ucam1.9(2Y1) Ucam3.10(I1) ; port CamData0
Cam_Data1: Ucam2.9(2Y1) Ucam4.10(I1) ; port CamData1
Cam_Data2: Ucam1.12(1Y4) Ucam3.5(I1) ; port CamData2
Cam_Data3: Ucam2.12(1Y4) Ucam4.5(I1) ; port CamData3
Cam_Data4: Ucam1.7(2Y2) Ucam3.13(I1) ; port CamData4
Cam_Data5: Ucam2.7(2Y2) Ucam4.13(I1) ; port CamData5
Cam_Data6: Ucam1.14(1Y3) Ucam3.2(I1) ; port CamData6
Cam_Data7: Ucam2.14(1Y3) Ucam4.2(I1) ; port CamData7
Cam_Data8: Ucam1.5(2Y3) Ucam5.10(I1) ; port CamData8
Cam_Data9: Ucam2.5(2Y3) Ucam6.10(I1) ; port CamData9
Cam_Data10: Ucam1.16(1Y2) Ucam5.5(I1) ; port CamData10
Cam_Data11: Ucam2.16(1Y2) Ucam6.5(I1) ; port CamData11
Cam_Data12: Ucam1.3(2Y4) Ucam5.13(I1) ; port CamData12
Cam_Data13: Ucam2.3(2Y4) Ucam6.13(I1) ; port CamData13
Cam_Data14: Ucam1.18(1Y1) Ucam5.2(I1) ; port CamData14
Cam_Data15: Ucam2.18(1Y1) Ucam6.2(I1) ; port CamData15
F1: Rc6.2 ; port CamF1  [project net CamF1]
F2: Rc4.2 ; port CamF2  [project net CamF2]
F4: Rc3.2 ; port CamF4  [project net CamF4]
F8: Rc2.2 ; port CamF8  [project net CamF8]
F16: Rc1.2 ; port CamF16  [project net CamF16]
I: Rc7.1 ; port CamI  [project net CamI]
L: Rc13.1 ; port CamL  [project net CamL]
N: Rc11.1 ; port CamN  [project net CamN]
Q: Rc18.2 ; port CamQ  [project net CamQ]
R1: Rc50.1 Ucam3.8(~{O}) VD2.3
R2: Rc49.1 Ucam4.8(~{O}) VD1.3
R3: Rc48.2 Ucam3.6(~{O})
R4: Rc47.1 Ucam4.6(~{O})
R5: Rc46.2 Ucam3.11(~{O})
R6: Rc45.1 Ucam4.11(~{O})
R7: Rc44.2 Ucam3.3(~{O})
R8: Rc43.1 Ucam4.3(~{O})
R9: Rc42.2 Ucam5.8(~{O})
R10: Rc41.1 Ucam6.8(~{O})
R11: Rc40.2 Ucam5.6(~{O})
R12: Rc39.1 Ucam6.6(~{O})
R13: Rc38.2 Ucam5.11(~{O})
R14: Rc37.1 Ucam6.11(~{O})
R15: Rc36.2 Ucam5.3(~{O})
R16: Rc35.1 Ucam6.3(~{O})
RPort_En: Ucam3.1(I0) Ucam3.4(I0) Ucam3.9(I0) Ucam3.12(I0) Ucam4.1(I0) Ucam4.4(I0) Ucam4.9(I0) Ucam4.12(I0) Ucam5.1(I0) Ucam5.4(I0) Ucam5.9(I0) Ucam5.12(I0) Ucam6.1(I0) Ucam6.4(I0) Ucam6.9(I0) Ucam6.12(I0) ; port RPortEn
S1: Rc15.1 ; port CamS1  [project net CamS1]
S2: Rc17.1 ; port CamS2  [project net CamS2]
W1: Rc34.2 Ucam1.11(2A1)
W2: Rc33.1 Ucam2.11(2A1)
W3: Rc32.2 Ucam1.8(1A4)
W4: Rc31.1 Ucam2.8(1A4)
W5: Rc30.2 Ucam1.13(2A2)
W6: Rc29.1 Ucam2.13(2A2)
W7: Rc28.2 Ucam1.6(1A3)
W8: Rc27.1 Ucam2.6(1A3)
W9: Rc26.2 Ucam1.15(2A3)
W10: Rc25.1 Ucam2.15(2A3)
W11: Rc24.2 Ucam1.4(1A2)
W12: Rc23.1 Ucam2.4(1A2)
W13: Rc22.2 Ucam1.17(2A4)
W14: Rc21.1 Ucam2.17(2A4)
W15: Rc20.2 Ucam1.2(1A1)
W16: Rc19.1 Ucam2.2(1A1)
WPort_En: Ucam1.1(~{1EZ}) Ucam1.19(~{2EZ}) Ucam2.1(~{1EZ}) Ucam2.19(~{2EZ}) ; port WPortEn
X: Rc5.1 ; port CamX  [project net CamX]
Z: Rc16.2 ; port CamZ  [project net CamZ]
NetJ1_A6: J1.A6(X) Rc5.2
NetJ1_A7: J1.A7(I) Rc7.2
NetJ1_A8: J1.A8(C) Rc9.2
NetJ1_A9: J1.A9(N) Rc11.2
NetJ1_A10: J1.A10(L) Rc13.2
NetJ1_A11: J1.A11(S1) Rc15.2
NetJ1_A12: J1.A12(S2) Rc17.2
NetJ1_A17: J1.A17(W16) Rc19.2
NetJ1_A18: J1.A18(W14) Rc21.2
NetJ1_A19: J1.A19(W12) Rc23.2
NetJ1_A20: J1.A20(W10) Rc25.2
NetJ1_A21: J1.A21(W8) Rc27.2
NetJ1_A22: J1.A22(W6) Rc29.2
NetJ1_A23: J1.A23(W4) Rc31.2
NetJ1_A24: J1.A24(W2) Rc33.2
NetJ1_A29: J1.A29(R16) Rc35.2
NetJ1_A30: J1.A30(R14) Rc37.2
NetJ1_A31: J1.A31(R12) Rc39.2
NetJ1_A32: J1.A32(R10) Rc41.2
NetJ1_A33: J1.A33(R8) Rc43.2
NetJ1_A34: J1.A34(R6) Rc45.2
NetJ1_A35: J1.A35(R4) Rc47.2
NetJ1_A36: J1.A36(R2) Rc49.2
NetJ1_B2: J1.B2(F16) Rc1.1
NetJ1_B3: J1.B3(F8) Rc2.1
NetJ1_B4: J1.B4(F4) Rc3.1
NetJ1_B5: J1.B5(F2) Rc4.1
NetJ1_B6: J1.B6(F1) Rc6.1
NetJ1_B7: J1.B7(A8) Rc8.1
NetJ1_B8: J1.B8(A4) Rc10.1
NetJ1_B9: J1.B9(A2) Rc12.1
NetJ1_B10: J1.B10(A1) Rc14.1
NetJ1_B11: J1.B11(Z) Rc16.1
NetJ1_B12: J1.B12(Q) Rc18.1
NetJ1_B17: J1.B17(W15) Rc20.1
NetJ1_B18: J1.B18(W13) Rc22.1
NetJ1_B19: J1.B19(W11) Rc24.1
NetJ1_B20: J1.B20(W9) Rc26.1
NetJ1_B21: J1.B21(W7) Rc28.1
NetJ1_B22: J1.B22(W5) Rc30.1
NetJ1_B23: J1.B23(W3) Rc32.1
NetJ1_B24: J1.B24(W1) Rc34.1
NetJ1_B29: J1.B29(R15) Rc36.1
NetJ1_B30: J1.B30(R13) Rc38.1
NetJ1_B31: J1.B31(R11) Rc40.1
NetJ1_B32: J1.B32(R9) Rc42.1
NetJ1_B33: J1.B33(R7) Rc44.1
NetJ1_B34: J1.B34(R5) Rc46.1
NetJ1_B35: J1.B35(R3) Rc48.1
NetJ1_B36: J1.B36(R1) Rc50.2

Not connected (* = marked no-connect by the designer): J1 A1(P1) A2(P2) A3(P3) A4(P4) A5(P5) A13(W24) A14(W22) A15(W20) A16(W18) A25(R24) A26(R22) A27(R20) A28(R18) A37(-12) A40(Y1) A41(+12) A42(Y2) B1(B) B13(W23) B14(W21) B15(W19) B16(W17) B25(R23) B26(R21) B27(R19) B28(R17); VD1 2; VD2 2

### Notes on the sheet
- IPT-LXe CAMAC part v2
- (in symbol 555LA13, part A) &
- (in symbol 555LA13, part B) &
- (in symbol 555LA13, part C) &
- (in symbol 555LA13, part D) &

### Library data of the parts
CCam1 = C POL
CCam2-CCam6 = C
J1 = CAMACF
L1 = INDUCTOR
Rc1-Rc50 = R: Text Field1: 20; Text Field2: 20
Ucam1 Ucam2 = 155AP3
Ucam3-Ucam6 = 555LA13: Text Field1: 20; Text Field2: 30
VD1 VD2 = BAV99: Double diode

## Sheet IPT-LXe Top.SchDoc
size 393 x 520 mm; SheetNumber: 0; SheetTotal: 0; PageSetup: Record=PageOptions|CenterHorizontal=True|CenterVertical=True|PrintScale=0.50|XCorrection=1.00|YCorrection=1.00|PrintKind=2|BorderSize=5000000|LeftOffset=0|BottomOffset=0|Orientation=1|PaperLength=1000|PaperWidth=1000|Scale=100|PaperSource=257|PrintQuality=600|MediaType=1|DitherType=10|PaperKind=A2|PrintScaleMode=1
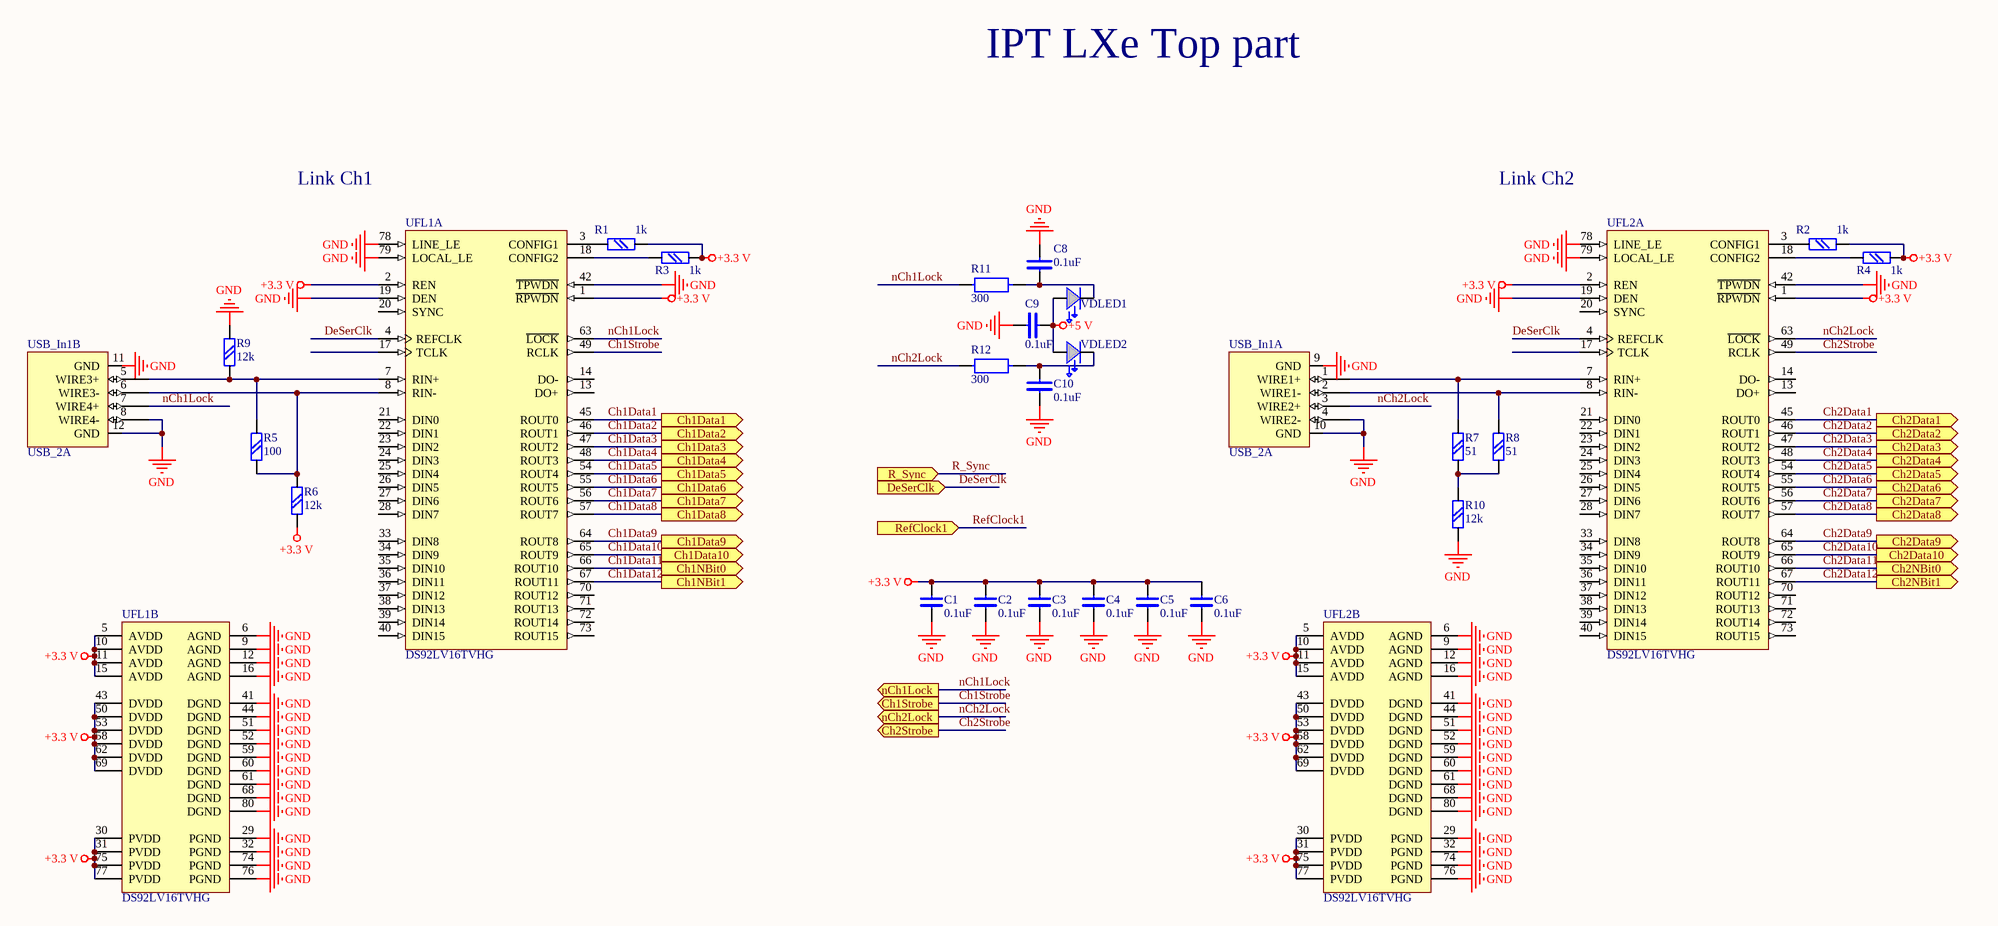
[diagram p4: IPT-LXe Top.SchDoc]

### Parts
C1  0.1uF  [chip0805]
C2  0.1uF  [chip0805]
C3  0.1uF  [chip0805]
C4  0.1uF  [chip0805]
C5  0.1uF  [chip0805]
C6  0.1uF  [chip0805]
C8  0.1uF  [chip0805]
C9  0.1uF  [chip0805]
C10  0.1uF  [chip0805]
R1  1k  [chip0805]
R2  1k  [chip0805]
R3  1k  [chip0805]
R4  1k  [chip0805]
R5  100  [chip0805]
R6  12k  [chip0805]
R7  51  [chip0805]
R8  51  [chip0805]
R9  12k  [chip0805]
R10  12k  [chip0805]
R11  300  [chip0805]
R12  300  [chip0805]
UFL1  DS92LV16TVHG  [VHG80A_N]  (parts A,B of 2)
UFL2  DS92LV16TVHG  [VHG80A_N]  (parts A,B of 2)
USB_In1  USB_2A  [USB_2A]  (parts A,B of 2)
VDLED1  LED  [LED2P5_H]  (value not drawn)
VDLED2  LED  [LED2P5_H]  (value not drawn)

### Ports
Ch1Data1 (out), Ch1Data2 (out), Ch1Data3 (out), Ch1Data4 (out), Ch1Data5 (out), Ch1Data6 (out), Ch1Data7 (out), Ch1Data8 (out), Ch1Data9 (out), Ch1Data10 (out), Ch1NBit0 (out), Ch1NBit1 (out), Ch1Strobe (out), Ch2Data1 (out), Ch2Data2 (out), Ch2Data3 (out), Ch2Data4 (out), Ch2Data5 (out), Ch2Data6 (out), Ch2Data7 (out), Ch2Data8 (out), Ch2Data9 (out), Ch2Data10 (out), Ch2NBit0 (out), Ch2NBit1 (out), Ch2Strobe (out), DeSerClk (in), nCh1Lock (out), nCh2Lock (out), R_Sync (in), RefClock1 (in)

### Nets
+3.3 V: C1.2 C2.2 C3.2 C4.2 C5.2 C6.2 R1.2 R2.2 R3.2 R4.2 R6.1 UFL1.1(~{RPWDN}) UFL1.2(REN) UFL1.5(AVDD) UFL1.10(AVDD) UFL1.11(AVDD) UFL1.15(AVDD) UFL1.30(PVDD) UFL1.31(PVDD) UFL1.43(DVDD) UFL1.50(DVDD) UFL1.53(DVDD) UFL1.58(DVDD) UFL1.62(DVDD) UFL1.69(DVDD) UFL1.75(PVDD) UFL1.77(PVDD) UFL2.1(~{RPWDN}) UFL2.2(REN) UFL2.5(AVDD) UFL2.10(AVDD) UFL2.11(AVDD) UFL2.15(AVDD) UFL2.30(PVDD) UFL2.31(PVDD) UFL2.43(DVDD) UFL2.50(DVDD) UFL2.53(DVDD) UFL2.58(DVDD) UFL2.62(DVDD) UFL2.69(DVDD) UFL2.75(PVDD) UFL2.77(PVDD)
+5 V: C9.2 VDLED1.ANOD VDLED2.ANOD
gnd: C1.1 C2.1 C3.1 C4.1 C5.1 C6.1 C8.1 C9.1 C10.2 R9.1 R10.1 UFL1.6(AGND) UFL1.9(AGND) UFL1.12(AGND) UFL1.16(AGND) UFL1.19(DEN) UFL1.29(PGND) UFL1.32(PGND) UFL1.41(DGND) UFL1.42(~{TPWDN}) UFL1.44(DGND) UFL1.51(DGND) UFL1.52(DGND) UFL1.59(DGND) UFL1.60(DGND) UFL1.61(DGND) UFL1.68(DGND) UFL1.74(PGND) UFL1.76(PGND) UFL1.78(LINE_LE) UFL1.79(LOCAL_LE) UFL1.80(DGND) UFL2.6(AGND) UFL2.9(AGND) UFL2.12(AGND) UFL2.16(AGND) UFL2.19(DEN) UFL2.29(PGND) UFL2.32(PGND) UFL2.41(DGND) UFL2.42(~{TPWDN}) UFL2.44(DGND) UFL2.51(DGND) UFL2.52(DGND) UFL2.59(DGND) UFL2.60(DGND) UFL2.61(DGND) UFL2.68(DGND) UFL2.74(PGND) UFL2.76(PGND) UFL2.78(LINE_LE) UFL2.79(LOCAL_LE) UFL2.80(DGND) USB_In1.4(WIRE2-) USB_In1.8(WIRE4-) USB_In1.9(GND) USB_In1.10(GND) USB_In1.11(GND) USB_In1.12(GND)
Ch1Data1: UFL1.45(ROUT0) ; port Ch1Data1
Ch1Data2: UFL1.46(ROUT1) ; port Ch1Data2
Ch1Data3: UFL1.47(ROUT2) ; port Ch1Data3
Ch1Data4: UFL1.48(ROUT3) ; port Ch1Data4
Ch1Data5: UFL1.54(ROUT4) ; port Ch1Data5
Ch1Data6: UFL1.55(ROUT5) ; port Ch1Data6
Ch1Data7: UFL1.56(ROUT6) ; port Ch1Data7
Ch1Data8: UFL1.57(ROUT7) ; port Ch1Data8
Ch1Data9: UFL1.64(ROUT8) ; port Ch1Data9
Ch1Data10: UFL1.65(ROUT9) ; port Ch1Data10
Ch1Data11: UFL1.66(ROUT10) ; port Ch1NBit0
Ch1Data12: UFL1.67(ROUT11) ; port Ch1NBit1
Ch1Strobe: UFL1.49(RCLK) ; port Ch1Strobe
Ch2Data1: UFL2.45(ROUT0) ; port Ch2Data1
Ch2Data2: UFL2.46(ROUT1) ; port Ch2Data2
Ch2Data3: UFL2.47(ROUT2) ; port Ch2Data3
Ch2Data4: UFL2.48(ROUT3) ; port Ch2Data4
Ch2Data5: UFL2.54(ROUT4) ; port Ch2Data5
Ch2Data6: UFL2.55(ROUT5) ; port Ch2Data6
Ch2Data7: UFL2.56(ROUT6) ; port Ch2Data7
Ch2Data8: UFL2.57(ROUT7) ; port Ch2Data8
Ch2Data9: UFL2.64(ROUT8) ; port Ch2Data9
Ch2Data10: UFL2.65(ROUT9) ; port Ch2Data10
Ch2Data11: UFL2.66(ROUT10) ; port Ch2NBit0
Ch2Data12: UFL2.67(ROUT11) ; port Ch2NBit1
Ch2Strobe: UFL2.49(RCLK) ; port Ch2Strobe
DeSerClk: UFL1.4(REFCLK) UFL2.4(REFCLK) ; port DeSerClk
nCh1Lock: R11.1 UFL1.63(~{LOCK}) USB_In1.7(WIRE4+) ; port nCh1Lock
nCh2Lock: R12.1 UFL2.63(~{LOCK}) USB_In1.3(WIRE2+) ; port nCh2Lock
NetC8_2: C8.2 R11.2 VDLED1.CATH
NetC10_1: C10.1 R12.2 VDLED2.CATH
NetR1_1: R1.1 UFL1.3(CONFIG1)
NetR2_1: R2.1 UFL2.3(CONFIG1)
NetR3_1: R3.1 UFL1.18(CONFIG2)
NetR4_1: R4.1 UFL2.18(CONFIG2)
NetR5_1: R5.1 R6.2 UFL1.8(RIN-) USB_In1.6(WIRE3-)
NetR5_2: R5.2 R9.2 UFL1.7(RIN+) USB_In1.5(WIRE3+)
NetR7_1: R7.1 R8.1 R10.2
NetR7_2: R7.2 UFL2.7(RIN+) USB_In1.1(WIRE1+)
NetR8_2: R8.2 UFL2.8(RIN-) USB_In1.2(WIRE1-)

Not connected (* = marked no-connect by the designer): UFL1 13(DO+) 14(DO-) 17(TCLK) 20(SYNC) 21(DIN0) 22(DIN1) 23(DIN2) 24(DIN3) 25(DIN4) 26(DIN5) 27(DIN6) 28(DIN7) 33(DIN8) 34(DIN9) 35(DIN10) 36(DIN11) 37(DIN12) 38(DIN13) 39(DIN14) 40(DIN15) 70(ROUT12) 71(ROUT13) 72(ROUT14) 73(ROUT15); UFL2 13(DO+) 14(DO-) 17(TCLK) 20(SYNC) 21(DIN0) 22(DIN1) 23(DIN2) 24(DIN3) 25(DIN4) 26(DIN5) 27(DIN6) 28(DIN7) 33(DIN8) 34(DIN9) 35(DIN10) 36(DIN11) 37(DIN12) 38(DIN13) 39(DIN14) 40(DIN15) 70(ROUT12) 71(ROUT13) 72(ROUT14) 73(ROUT15)

### Notes on the sheet
- IPT LXe Top part
- Link Ch1
- Link Ch2

### Library data of the parts
C1-C6 = C: Text Field1: 20; Text Field2: 10
C8-C10 = C
R1-R10 = R: Text Field1: 20; Text Field2: 20
R11 R12 = R
UFL1 UFL2 = DS92LV16TVHG: 16-Bit Bus LVDS Serializer/Deserializer - 25 - 80 MHz, 80-pin LQFP; Manufacturer: National Semiconductor; PackageTopMarking: NSUZXYTTE#*DS92LV16TVHG*BBBBB; PowerWise: N; CompType: Interface IC; Published: 4-Dec-2008; DatasheetVersion: Feb-2002; PackageVersion: revE, Feb-2005; PackageReference: VHG80A; Publisher: Altium Limited; PackageDescription: LQFP, Jedec, Metric, 12 x 12 x 1.4mm, 80 Lead, 0.5mm Pitch; Supplier 1: Farnell; Supplier Part Number 1: 8206848; PartNumber: DS92LV16TVHG; RoHS: N; PinCount: 80; Code_JEDEC: MS-026-BDD; ComponentLink1Description: DS92LV16 Datasheet; ComponentLink1URL: http://www.national.com/ds/DS/DS92LV16.pdf; ComponentLink2Description: DS92LV16 Web Page; ComponentLink2URL: http://www.national.com/pf/DS/DS92LV16.html; ComponentLink3Description: VHG80A Package Page; ComponentLink3URL: http://www.national.com/packaging/folders/vhg80a.html
VDLED1 VDLED2 = AL307: Text Field1: 10; Text Field2: 30